# EAGLE design ledbtn (EAGLE 4.16)
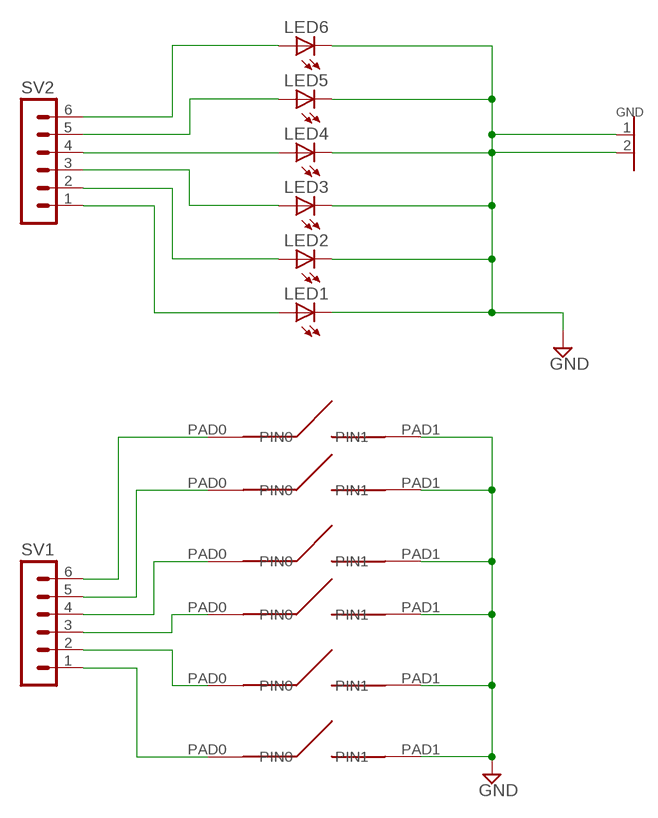
[diagram p0: schematic, sheet 1]

## Parts
GND  PINHDR2  [1X02]
LED1  LED5MM  [LED5MM]
LED2  LED5MM  [LED5MM]
LED3  LED5MM  [LED5MM]
LED4  LED5MM  [LED5MM]
LED5  LED5MM  [LED5MM]
LED6  LED5MM  [LED5MM]
SV1  MA06-1  [MA06-1]
SV2  MA06-1  [MA06-1]
U$1  MULTICOMP_TACT_SWITCH  [MULTICOMP_TACT_SWITCH]
U$2  MULTICOMP_TACT_SWITCH  [MULTICOMP_TACT_SWITCH]
U$3  MULTICOMP_TACT_SWITCH  [MULTICOMP_TACT_SWITCH]
U$4  MULTICOMP_TACT_SWITCH  [MULTICOMP_TACT_SWITCH]
U$5  MULTICOMP_TACT_SWITCH  [MULTICOMP_TACT_SWITCH]
U$6  MULTICOMP_TACT_SWITCH  [MULTICOMP_TACT_SWITCH]

## Nets
GND: GND.1 GND.2 LED1.K(C) LED2.K(C) LED3.K(C) LED4.K(C) LED5.K(C) LED6.K(C) U$1.PAD1(PIN1) U$2.PAD1(PIN1) U$3.PAD1(PIN1) U$4.PAD1(PIN1) U$5.PAD1(PIN1) U$6.PAD1(PIN1)
N$2: LED6.A SV2.6
N$3: LED5.A SV2.5
N$4: LED4.A SV2.4
N$5: LED3.A SV2.3
N$6: LED2.A SV2.2
N$7: LED1.A SV2.1
N$8: SV1.6 U$1.PAD0(PIN0)
N$9: SV1.5 U$2.PAD0(PIN0)
N$10: SV1.4 U$3.PAD0(PIN0)
N$11: SV1.3 U$4.PAD0(PIN0)
N$12: SV1.2 U$5.PAD0(PIN0)
N$13: SV1.1 U$6.PAD0(PIN0)

## Library data of the parts
GND = dongle:PINHDR2
LED1-LED6 = led:LED: LED OSRAM: - CHIPLED LG R971, LG N971, LY N971, LG Q971, LY Q971, LO R971, LY R971 LH N974, LH R974 LS Q976, LO Q976, LY Q976 LO Q996 - Hyper CHIPLED LW Q18S LB Q993, LB Q99A, LB R99A - SideLED LS A670, LO A670, LY A670, LG A670, LP A670 LB A673, LV A673, LT A673, LW A673 LH A674 LY A675 LS A676, LA A676, LO A676, LY A676, LW A676 LS A679, LY A679, LG A679 - Hyper Micro SIDELED® LS Y876, LA Y876, LO Y876, LY Y876 LT Y87S - SmartLED LW L88C, LW L88S LB L89C, LB L89S, LG L890 LS L89K, LO L89K, LY L89K LS L896, LA L896, LO L896, LY L896 - TOPLED LS T670, LO T670, LY T670, LG T670, LP T670 LSG T670, LSP T670, LSY T670, LOP T670, LYG T670 LG T671, LOG T671, LSG T671 LB T673, LV T673, LT T673, LW T673 LH T674 LS T676, LA T676, LO T676, LY T676, LB T676, LH T676, LSB T676, LW T676 LB T67C, LV T67C, LT T67C, LS T67K, LO T67K, LY T67K, LW E67C LS E67B, LA E67B, LO E67B, LY E67B, LB E67C, LV E67C, LT E67C LW T67C LS T679, LY T679, LG T679 LS T770, LO T770, LY T770, LG T770, LP T770 LB T773, LV T773, LT T773, LW T773 LH T774 LS E675, LA E675, LY E675, LS T675 LS T776, LA T776, LO T776, LY T776, LB T776 LHGB T686 LT T68C, LB T68C - Hyper Mini TOPLED® LB M676 - Mini TOPLED Santana® LG M470 LS M47K, LO M47K, LY M47K Source: http://www.osram.convergy.de - LUMILED® LXK2-PW12-R00, LXK2-PW12-S00, LXK2-PW14-U00, LXK2-PW14-V00 LXK2-PM12-R00, LXK2-PM12-S00, LXK2-PM14-U00 LXK2-PE12-Q00, LXK2-PE12-R00, LXK2-PE12-S00, LXK2-PE14-T00, LXK2-PE14-U00 LXK2-PB12-K00, LXK2-PB12-L00, LXK2-PB12-M00, LXK2-PB14-N00, LXK2-PB14-P00, LXK2-PB14-Q00 LXK2-PR12-L00, LXK2-PR12-M00, LXK2-PR14-Q00, LXK2-PR14-R00 LXK2-PD12-Q00, LXK2-PD12-R00, LXK2-PD12-S00 LXK2-PH12-R00, LXK2-PH12-S00 LXK2-PL12-P00, LXK2-PL12-Q00, LXK2-PL12-R00 Source: www.luxeon.com
SV1 SV2 = con-lstb:MA06-1: PIN HEADER
U$1-U$6 = pnp:MULTICOMP_TACT_SWITCH

## Board
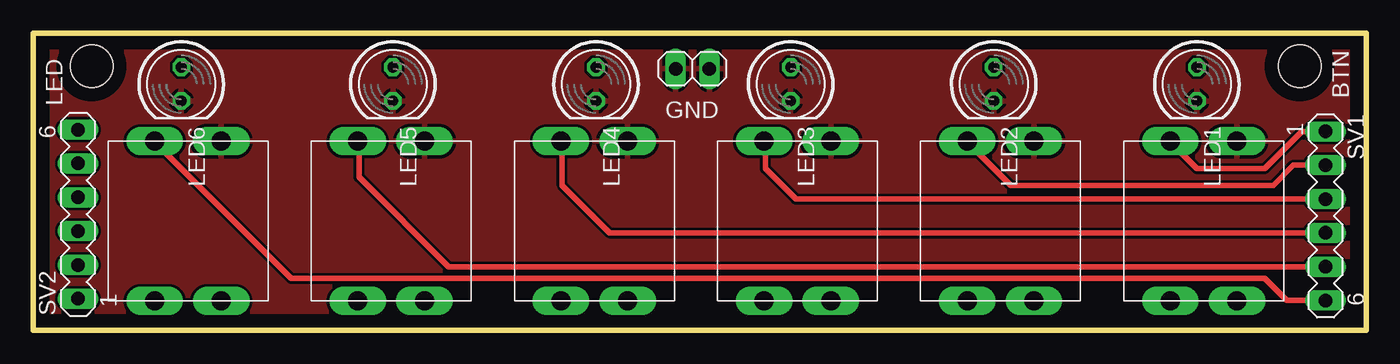
[diagram p1: board, top side]
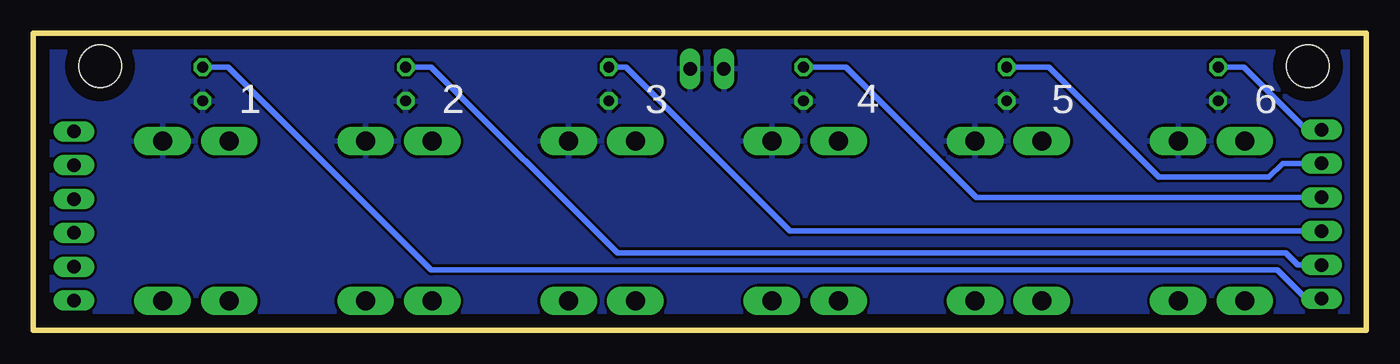
[diagram p2: board, bottom side, seen from below]

Size 100 x 22.3 mm. Coordinates in mm from the lower left corner, seen from the top.
Outline: 100,22.3 100,0 0,0 0,22.3 100,22.3
Copper layers (1*16): Top 0.035mm / dielectric 1.5mm / Bottom 0.035mm
Design rules "default": minimum track width 10mil, minimum drill 24mil, track to track 8mil, track to pad 8mil, pad to pad 8mil, via to via 8mil, smd to smd 8mil, copper to edge 40mil, drill to drill 8mil, minimum pad ring 10mil, minimum via ring 8mil, stop-mask expansion 4mil, vias tented up to drill 0mil, thermal gap 10mil
Holes 3.2 mm at 95,19.84 4.36,19.84

### Footprints (pad centres in the part's own frame; a part is rotated, then mirrored left to right if it is on the bottom)
1X02 = drill 1.016 long: 1 -1.27,0; 2 1.27,0
LED5MM = drill 0.813 octagon: A -1.27,0; K 1.27,0
MA06-1 = drill 1.016 long: 1 -6.35,0; 2 -3.81,0; 3 -1.27,0; 4 1.27,0; 5 3.81,0; 6 6.35,0
MULTICOMP_TACT_SWITCH = drill 1.422 long: NC0 -2.5,-6; NC1 2.5,-6; PAD0 -2.5,6; PAD1 2.5,6

### Placement (x,y rotation side)
GND  49.45,19.63 180 top
LED1  87.3,18.49 270 top
LED2  72.06,18.49 270 top
LED3  56.82,18.49 270 top
LED4  42.21,18.49 270 top
LED5  26.98,18.49 270 top
LED6  11.1,18.49 270 top
SV1  96.95,8.58 270 top
SV2  3.35,8.71 90 top
U$1  11.61,8.2 0 top
U$2  26.85,8.2 0 top
U$3  42.09,8.2 0 top
U$4  57.33,8.2 0 top
U$5  72.57,8.2 0 top
U$6  87.81,8.2 0 top

### Tracks (layer width: path | path; a pad name or v marks a point on that pad's centre or on a via)
GND
  pour Bottom: 100,-0.56 100,22.3 99.37,22.93 0.3,22.93 -0.33,23.57 -0.33,-0.56
  pour Top: 100,-0.56 100,22.93 -0.33,22.93 -0.33,-0.56
N$2
  Bottom 0.406: SV2.6 4.5,15.06 9.2,19.76 LED6.A
N$3
  Bottom 0.406: SV2.5 6.27,12.52 7.29,11.5 15.54,11.5 23.8,19.76 LED5.A
N$4
  Bottom 0.406: SV2.4 29.26,9.98 39.04,19.76 LED4.A
N$5
  Bottom 0.406: SV2.3 43.23,7.44 55.55,19.76 LED3.A
N$6
  Bottom 0.406: SV2.2 5.13,4.9 6.02,5.79 56.19,5.79 70.16,19.76 LED2.A
N$7
  Bottom 0.406: SV2.1 4.5,2.36 6.65,4.52 70.16,4.52 85.4,19.76 LED1.A
N$8
  Top 0.406: SV1.6 94.03,2.23 92.38,3.89 19.36,3.89 9.11,14.13 U$1.PAD0
N$9
  Top 0.406: SV1.5 31.17,4.77 24.43,11.5 24.43,14.04 24.35,14.13 U$2.PAD0
N$10
  Top 0.406: SV1.4 43.23,7.31 39.67,10.87 39.67,14.04 39.59,14.13 U$3.PAD0
N$11
  Top 0.406: SV1.3 57.2,9.85 54.91,12.14 54.91,14.04 54.83,14.13 U$4.PAD0
N$12
  Top 0.406: SV1.2 94.54,12.39 93.02,10.87 73.33,10.87 70.07,14.13 U$5.PAD0
N$13
  Top 0.406: SV1.1 95.17,14.93 92.38,12.14 87.3,12.14 85.31,14.13 U$6.PAD0

### Text on the board
tNames: BTN | LED
bNames: 6 | 5 | 4 | 3 | 2 | 1